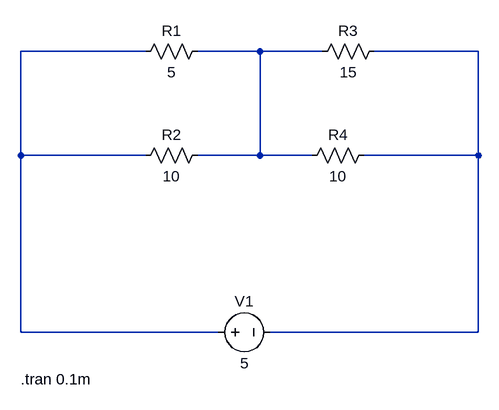
[diagram p0: schematic basic-1.asc]
basic-1.asc, the LTspice schematic file:
Version 4.1
SHEET 1 880 680
WIRE 96 48 -96 48
WIRE 272 48 176 48
WIRE 368 48 272 48
WIRE 608 48 448 48
WIRE -96 208 -96 48
WIRE 96 208 -96 208
WIRE 272 208 272 48
WIRE 272 208 176 208
WIRE 352 208 272 208
WIRE 608 208 608 48
WIRE 608 208 432 208
WIRE -96 480 -96 208
WIRE 208 480 -96 480
WIRE 608 480 608 208
WIRE 608 480 288 480
SYMBOL res 192 32 R90
WINDOW 0 0 56 VBottom 2
WINDOW 3 32 56 VTop 2
SYMATTR InstName R1
SYMATTR Value 5
SYMBOL res 192 192 R90
WINDOW 0 0 56 VBottom 2
WINDOW 3 32 56 VTop 2
SYMATTR InstName R2
SYMATTR Value 10
SYMBOL res 464 32 R90
WINDOW 0 0 56 VBottom 2
WINDOW 3 32 56 VTop 2
SYMATTR InstName R3
SYMATTR Value 15
SYMBOL res 448 192 R90
WINDOW 0 0 56 VBottom 2
WINDOW 3 32 56 VTop 2
SYMATTR InstName R4
SYMATTR Value 10
SYMBOL voltage 192 480 R270
WINDOW 0 32 56 VTop 2
WINDOW 3 -32 56 VBottom 2
WINDOW 123 0 0 Left 0
WINDOW 39 0 0 Left 0
SYMATTR InstName V1
SYMATTR Value 5
TEXT -96 552 Left 2 !.tran 0.1m

The netlist it stands for:
* basic-1.asc
R1 N002 N001 5
R2 N002 N001 10
R3 N003 N002 15
R4 N003 N002 10
V1 N001 N003 5
.tran 0.1m
.backanno
.end